# Altium schematic sheet TOF_GND_SCHEME.SchDoc: My title
size A3; Organization: University of California; Address1: 475 Portola Plaza; Address2: Los Angeles, CA 90095; DocumentNumber: 2; Revision: R01; SheetNumber: 2; SheetTotal: 35
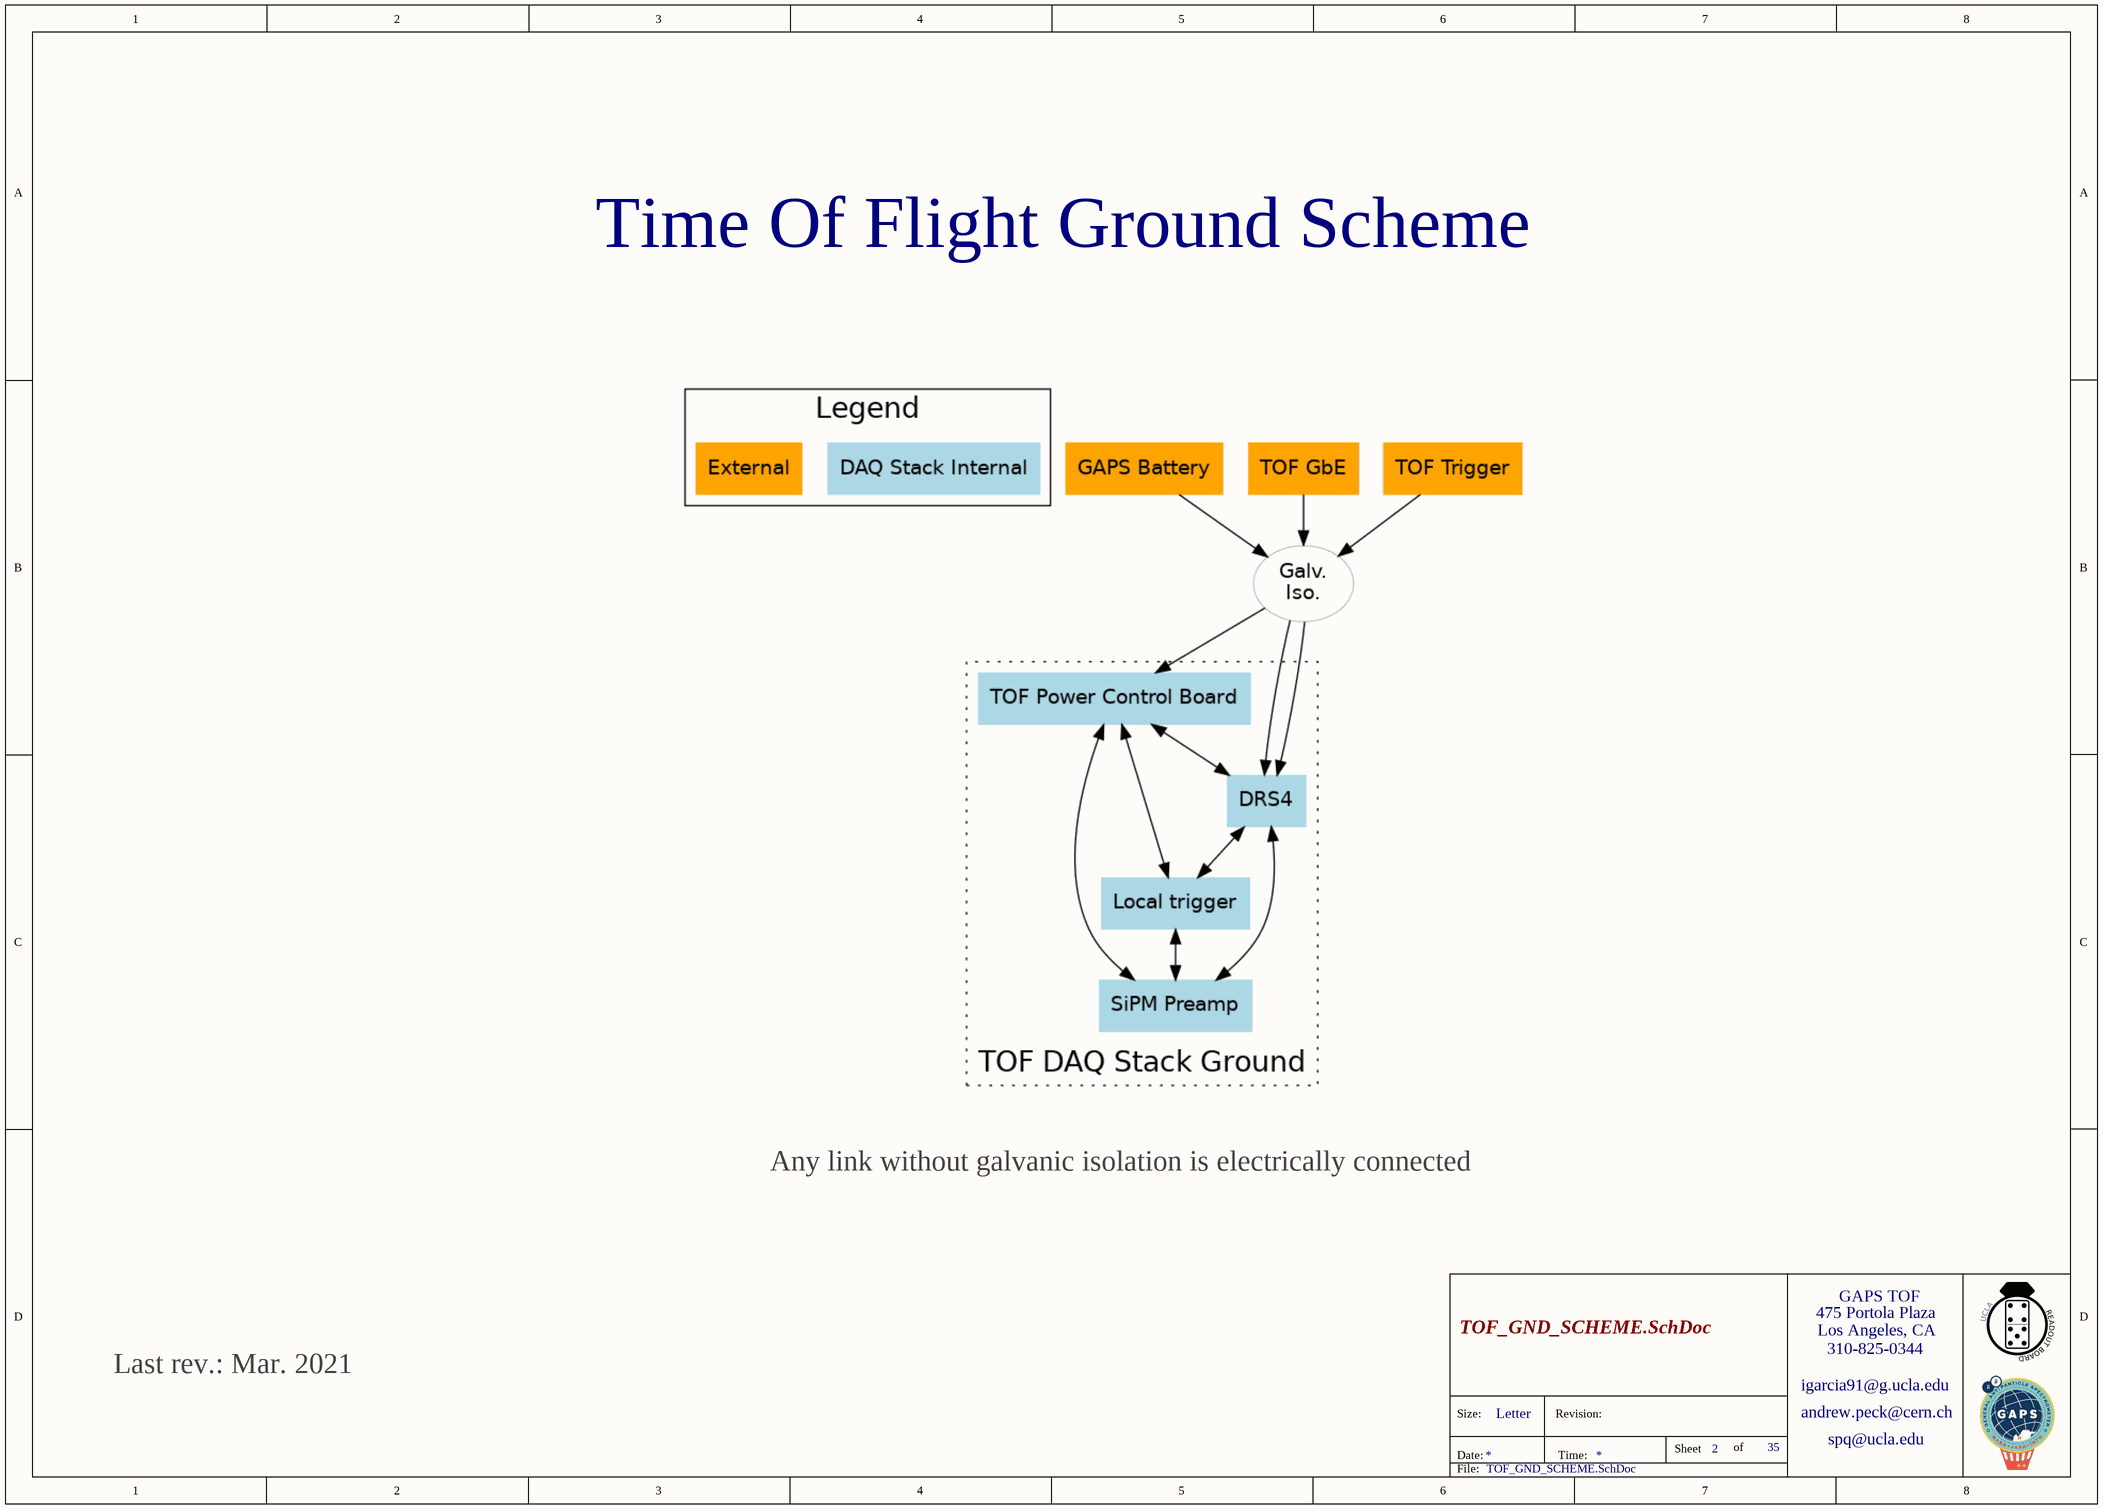
[diagram p0: TOF_GND_SCHEME.SchDoc]

## Notes on the sheet
- Time Of Flight Ground Scheme
- Any link without galvanic isolation is electrically connected
- Last rev.: Mar. 2021
- 475 Portola Plaza
- GAPS TOF
- igarcia91@g.ucla.edu
- Los Angeles, CA
- 310-825-0344
- Size:
- Date:
- Letter
- Revision:
- Time:
- Sheet
- of
- andrew.peck@cern.ch
- spq@ucla.edu
- File: